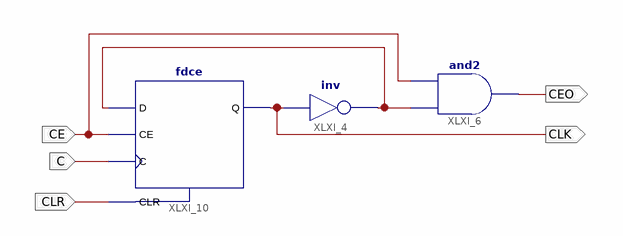
[diagram p0: schematic sheet 1]
// Xilinx ISE schematic ClockDivider_2.sch (spartan6) as structural Verilog: 3 symbols, 5 ports
module ClockDivider_2 (
  input  C,
  input  CE,
  input  CLR,
  output CLK,
  output CEO
);

  wire XLXN_14;

  not XLXI_4 (XLXN_14, CLK);
  and XLXI_6 (CEO, XLXN_14, CE);
  fdce XLXI_10 (.C(C), .CE(CE), .CLR(CLR), .D(XLXN_14), .Q(CLK));
endmodule
